# EAGLE design Naninator (EAGLE 6.2)
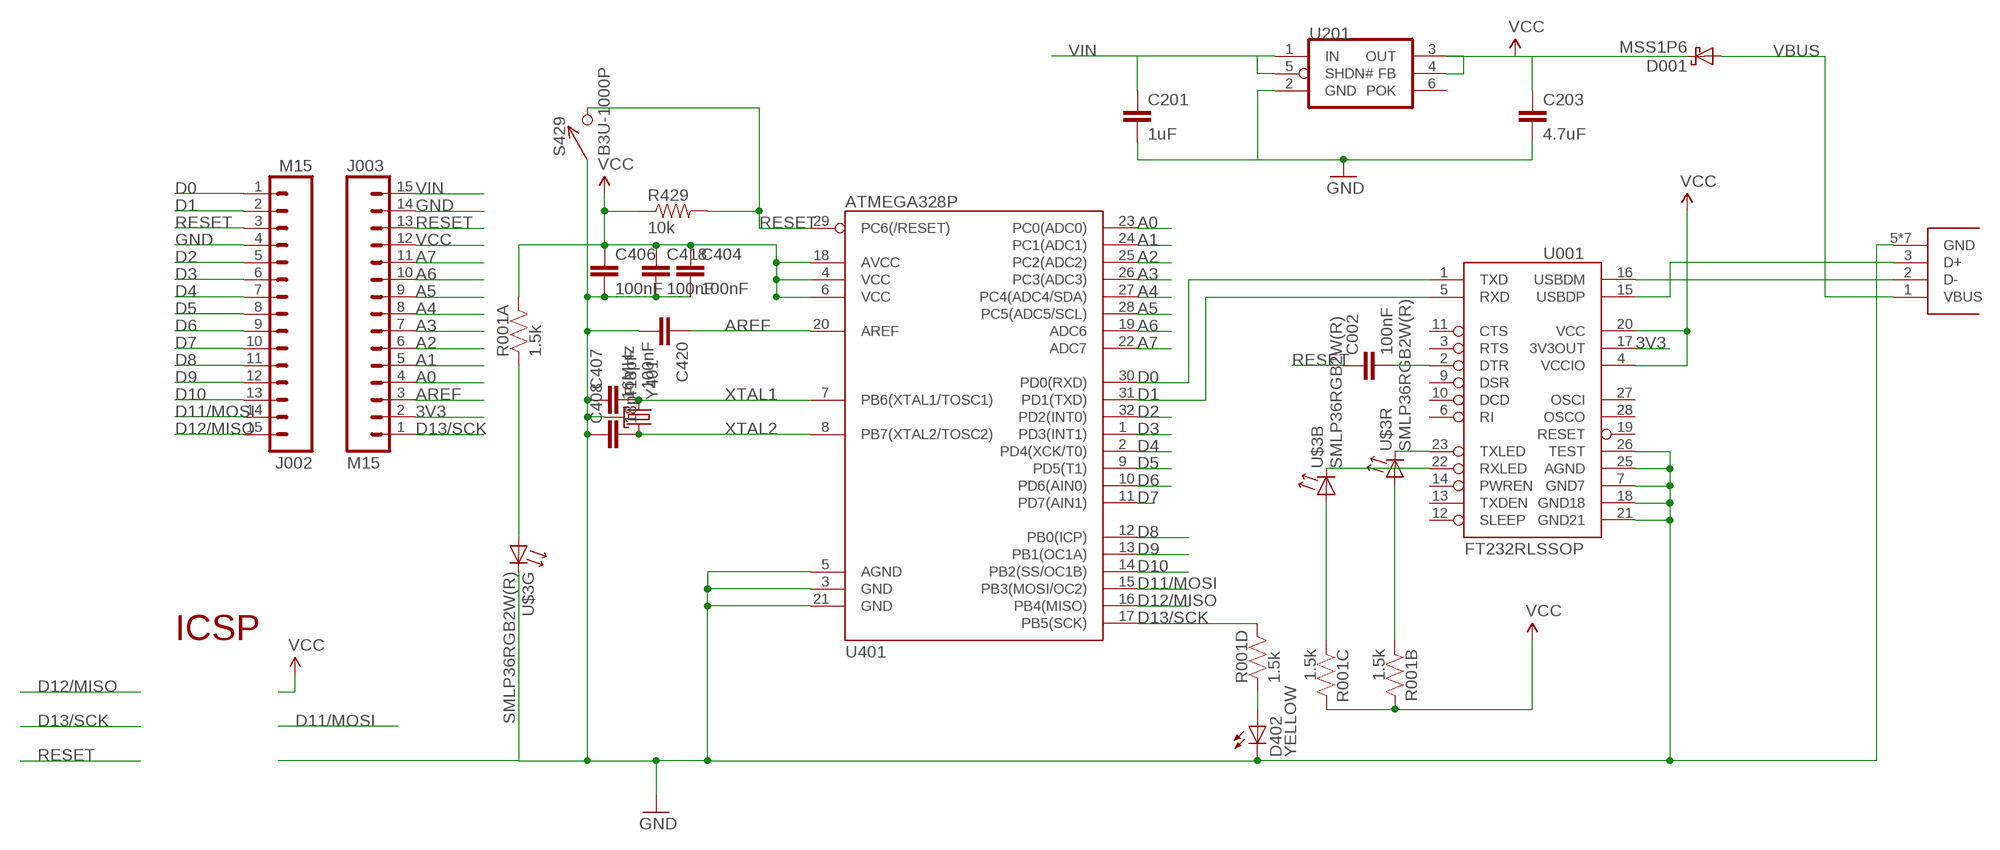
[diagram p0: schematic, sheet 1]

## Parts
C002  100nF  CAP0402-CAP  [0402-CAP]
C201  1uF  CAP0402-CAP  [0402-CAP]
C203  4.7uF  CAP0402-CAP  [0402-CAP]
C404  100nF  CAP0402-CAP  [0402-CAP]
C406  100nF  CAP0402-CAP  [0402-CAP]
C407  18pF  CAP0402-CAP  [0402-CAP]
C408  18pF  CAP0402-CAP  [0402-CAP]
C418  100nF  CAP0402-CAP  [0402-CAP]
C420  100nF  CAP0402-CAP  [0402-CAP]
D001  MSS1P6  [MICROSMP]
D402  YELLOW  LED0603  [LED-0603]
J001  USB_MICROB_JSTGCT  [USB_MICROB_3075]
J002  M15  [1X15]
J003  M15  [1X15]
R001  1.5k  RP404  [CRA04]
R429  10k  RESISTOR0402-RES  [0402-RES]
S429  B3U-1000P  [B3U-1000P]
U001  FT232RLSSOP  [SSOP28DB]
U201  MAX8881  [SOT-23-6]
U401  ATMEGA328P  ATMEGA168  [TQFP32-08]
U$3  SMLP36RGB2W(R)  [SMLP36]
Y401  16MHz  CX25208Y  [CRYSTAL_SMD_2MM_1_6MM]

## Nets
3V3: J003.2 U001.17(3V3OUT)
A0: J003.4 U401.23(PC0(ADC0))
A1: J003.5 U401.24(PC1(ADC1))
A2: J003.6 U401.25(PC2(ADC2))
A3: J003.7 U401.26(PC3(ADC3))
A4: J003.8 U401.27(PC4(ADC4/SDA))
A5: J003.9 U401.28(PC5(ADC5/SCL))
A6: J003.10 U401.19(ADC6)
A7: J003.11 U401.22(ADC7)
AREF: C420.1 J003.3 U401.20(AREF)
D0: J002.1 U001.1(TXD) U401.30(PD0(RXD))
D1: J002.2 U001.5(RXD) U401.31(PD1(TXD))
D2: J002.5 U401.32(PD2(INT0))
D3: J002.6 U401.1(PD3(INT1))
D4: J002.7 U401.2(PD4(XCK/T0))
D5: J002.8 U401.9(PD5(T1))
D6: J002.9 U401.10(PD6(AIN0))
D7: J002.10 U401.11(PD7(AIN1))
D8: J002.11 U401.12(PB0(ICP))
D9: J002.12 U401.13(PB1(OC1A))
D10: J002.13 U401.14(PB2(SS/OC1B))
D11/MOSI: J002.14 U401.15(PB3(MOSI/OC2))
D12/MISO: J002.15 U401.16(PB4(MISO))
D13/SCK: J003.1 R001.5 U401.17(PB5(SCK))
DTR#: C002.2 U001.2(DTR)
GND: C201.2 C203.2 C404.2 C406.2 C407.1 C408.1 C418.2 C420.2 D402.C J001.5(GND) J001.P$1(GND) J001.P$2(GND) J001.P$3(GND) J001.P$4(GND) J001.P$8(GND) J001.P$10(GND) J002.4 J003.14 S429.P$1 U001.7(GND7) U001.18(GND18) U001.21(GND21) U001.25(AGND) U001.26(TEST) U201.2(GND) U401.3(GND) U401.5(AGND) U401.21(GND) U$3.5(G:C) Y401.2(GND) Y401.4(GND)
N$3: J001.3(D+) U001.15(USBDP)
N$4: J001.2(D-) U001.16(USBDM)
N$5: R001.1 U$3.6(G:A)
N$6: R001.3 U$3.2(B:A)
N$7: R001.2 U$3.4(R:A)
N$8: D402.A R001.4
RESET: C002.1 J002.3 J003.13 R429.2 S429.P$2 U401.29(PC6(/RESET))
RXLED1: U001.22(RXLED) U$3.1(B:C)
TXLED1: U001.23(TXLED) U$3.3(R:C)
VBUS: D001.A J001.1(VBUS)
VCC: C203.1 C404.1 C406.1 C418.1 D001.K J003.12 R001.6 R001.7 R001.8 R429.1 U001.4(VCCIO) U001.20(VCC) U201.3(OUT) U201.4(FB) U401.4(VCC) U401.6(VCC) U401.18(AVCC)
VIN: C201.1 J003.15 U201.1(IN) U201.5(SHDN#)
XTAL1: C407.2 U401.7(PB6(XTAL1/TOSC1)) Y401.3
XTAL2: C408.2 U401.8(PB7(XTAL2/TOSC2)) Y401.1
Unconnected: U001.3(RTS) U001.6(RI) U001.9(DSR) U001.10(DCD) U001.11(CTS) U001.12(SLEEP) U001.13(TXDEN) U001.14(PWREN) U001.19(RESET) U001.27(OSCI) U001.28(OSCO) U201.6(POK)

## Notes on the sheet
- ICSP

## Library data of the parts
C002 C404 C406 C418 C420 = SparkFun:CAP: Capacitor Standard 0603 ceramic capacitor, and 0.1" leaded capacitor.; DIGIKEY: 445-1265-1-ND
C201 = SparkFun:CAP: Capacitor Standard 0603 ceramic capacitor, and 0.1" leaded capacitor.; DIGIKEY: 445-4114-1-ND
C203 = SparkFun:CAP: Capacitor Standard 0603 ceramic capacitor, and 0.1" leaded capacitor.; DIGIKEY: 445-7395-1-ND
C407 C408 = SparkFun:CAP: Capacitor Standard 0603 ceramic capacitor, and 0.1" leaded capacitor.; DIGIKEY: 445-1238-1-ND
D001 = KwanSystems:MSS1P6; DIGIKEY: MSS2P3-M3/89AGICT-ND
D402 = SparkFun-LED:LED: LEDs Standard schematic elements and footprints for 5mm, 3mm, 1206, and 0603 sized LEDs. 5mm - Spark Fun Electronics SKU : COM-00529 (and others); DIGIKEY: 350-2032-1-ND
J001 = KwanSystems:USB_MICROB_JST; DIGIKEY: 609-4616-2-ND
J002 J003 = SparkFun-Connectors:M15: Header 15 Standard 15-pin 0.1" header. Use with straight break away headers (SKU : PRT-00116), right angle break away headers (PRT-00553), swiss pins (PRT-00743), machine pins (PRT-00117), and female headers (PRT-00115).; DIGIKEY: A24931-ND
R001 = KwanSystems:RP4; DIGIKEY: CRA4S81.5KCT-ND
R429 = SparkFun-Passives:RESISTOR: Resistor Basic schematic elements and footprints for 0603, 1206, and PTH resistors.; DIGIKEY: P10.0KLCT-ND
S429 = KwanSystems:B3U-1000P; DIGIKEY: SW1020CT-ND
U001 = SparkFun-DigitalIC:FT232RL: USB UART FT232RL 4th Generation USB UART (USB <-> Serial) Controller. Spark Fun Electronics SKU : COM-00650; DIGIKEY: 768-1007-1-ND
U201 = KwanSystems:MAX8881; DIGIKEY: MAX8881EUT50+TCT-ND
U401 = SparkFun-DigitalIC:ATMEGA168: Atmel 32-pin 8-bit micro, 16k flash.; DIGIKEY: ATMEGA328P-15AZCT-ND
U$3 = KwanSystems:SMLP36RGB2W(R)
Y401 = KwanSystems:CX2520; DIGIKEY: 887-2003-1-ND

## Net classes
0 default: width 0.152 mm, drill 0.33 mm, clearance 0.152 mm

## Board
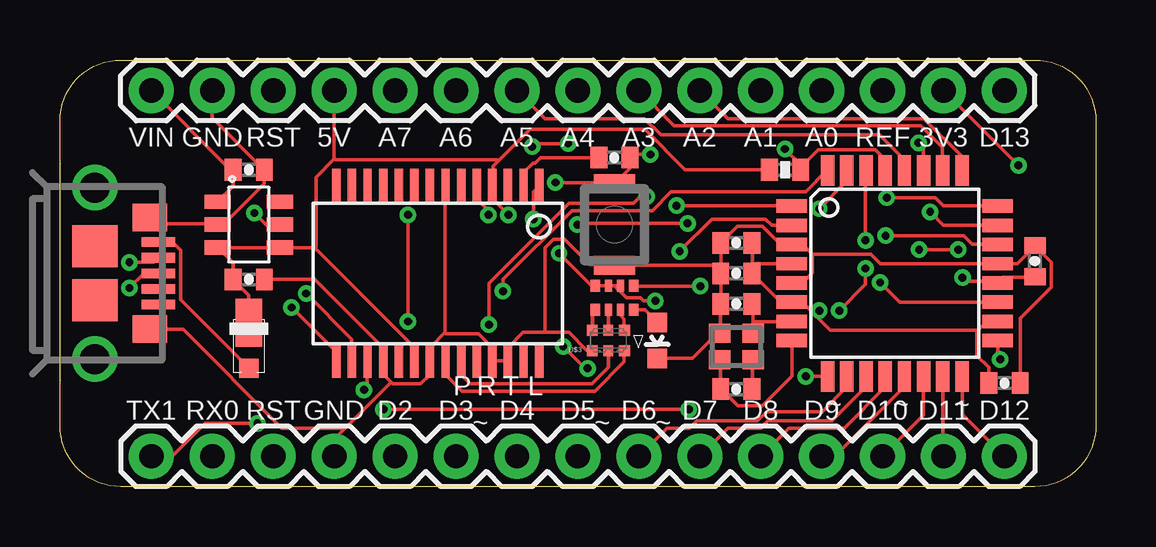
[diagram p1: board, top side]
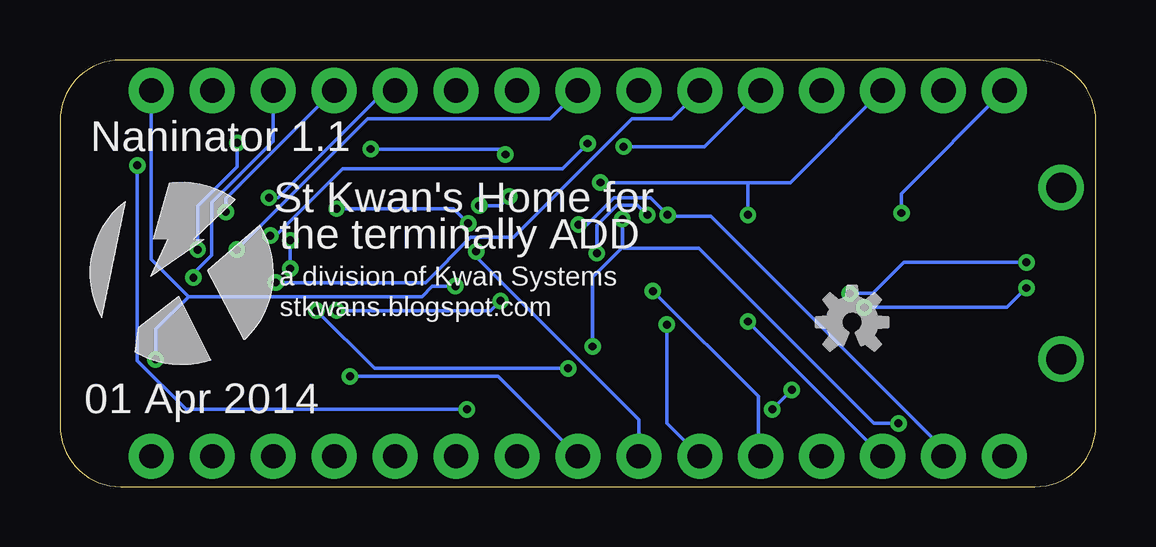
[diagram p2: board, bottom side, seen from below]

Size 43.18 x 17.78 mm. Coordinates in mm from the lower left corner, seen from the top.
Outline: 40.64,0 2.54,0 arc-90 0,2.54 0,15.24 arc-90 2.54,17.78 40.64,17.78 arc-90 43.18,15.24 43.18,2.54 arc-90 40.64,0
Copper layers (1*16): Top 0.0356mm / dielectric 1.5011mm / Bottom 0.0356mm
Design rules "default": minimum track width 6mil, minimum drill 13mil, track to track 6mil, track to pad 6mil, pad to pad 6mil, via to via 6mil, smd to smd 6mil, copper to edge 15mil, drill to drill 6mil, minimum pad ring 7mil, minimum via ring 7mil, stop-mask expansion 4mil, vias tented up to drill 14mil, thermal gap 10mil

### Footprints (pad centres in the part's own frame; a part is rotated, then mirrored left to right if it is on the bottom)
0402-CAP = smd 0.7 x 0.9: 1 -0.65,0; 2 0.65,0
MICROSMP = smd 0.8 x 0.8: A 0.9,0 | smd 2 x 1.1: K -1,0
LED-0603 = smd 0.8 x 0.8: A 0,-0.75; C 0,0.75
USB_MICROB_3075 = smd 0.4 x 1.4: 1 -1.3,4.1; 2 -0.65,4.1; 3 0,4.1; 4 0.65,4.1; 5 1.3,4.1 | smd 1.15 x 1.45: P$1 2.32,3.75; P$10 -2.32,3.75 | smd 1.75 x 1.9: P$2 1.125,1.45; P$8 -1.125,1.45 | drill 1.25 pad 1.9: P$3 -3.575,1.45; P$4 3.575,1.45
1X15 = drill 1.016 pad 1.88: 1 0,0; 2 2.54,0; 3 5.08,0; 4 7.62,0; 5 10.16,0; 6 12.7,0; 7 15.24,0; 8 17.78,0; 9 20.32,0; 10 22.86,0; 11 25.4,0; 12 27.94,0; 13 30.48,0; 14 33.02,0; 15 35.56,0
CRA04 = smd 0.4 x 0.5: 1 -0.8,-0.5; 4 0.8,-0.5; 5 0.8,0.5; 8 -0.8,0.5 | smd 0.3 x 0.5: 2 -0.25,-0.5; 3 0.25,-0.5; 6 0.25,0.5; 7 -0.25,0.5
0402-RES = smd 0.7 x 0.9: 1 -0.65,0; 2 0.65,0
B3U-1000P = smd 0.8 x 1.7: P$1 -1.7,0; P$2 1.7,0
SSOP28DB = smd 0.348 x 1.397: 1 -4.225,-3.656; 2 -3.575,-3.656; 3 -2.925,-3.656; 4 -2.275,-3.656; 5 -1.625,-3.656; 6 -0.975,-3.656; 7 -0.325,-3.656; 8 0.325,-3.656; 9 0.975,-3.656; 10 1.625,-3.656; 11 2.275,-3.656; 12 2.925,-3.656; 13 3.575,-3.656; 14 4.225,-3.656; 15 4.225,3.656; 16 3.575,3.656; 17 2.925,3.656; 18 2.275,3.656; 19 1.625,3.656; 20 0.975,3.656; 21 0.325,3.656; 22 -0.325,3.656; 23 -0.975,3.656; 24 -1.625,3.656; 25 -2.275,3.656; 26 -2.925,3.656; 27 -3.575,3.656; 28 -4.225,3.656
SOT-23-6 = smd 0.6 x 1.1: 1 -0.95,-1.3; 2 0,-1.3; 3 0.95,-1.3; 4 0.95,1.3; 5 0,1.3; 6 -0.95,1.3
TQFP32-08 = smd 1.27 x 0.559: 1 -4.293,2.8; 2 -4.293,2; 3 -4.293,1.2; 4 -4.293,0.4; 5 -4.293,-0.4; 6 -4.293,-1.2; 7 -4.293,-2; 8 -4.293,-2.8; 17 4.293,-2.8; 18 4.293,-2; 19 4.293,-1.2; 20 4.293,-0.4; 21 4.293,0.4; 22 4.293,1.2; 23 4.293,2; 24 4.293,2.8 | smd 0.559 x 1.27: 9 -2.8,-4.293; 10 -2,-4.293; 11 -1.2,-4.293; 12 -0.4,-4.293; 13 0.4,-4.293; 14 1.2,-4.293; 15 2,-4.293; 16 2.8,-4.293; 25 2.8,4.293; 26 2,4.293; 27 1.2,4.293; 28 0.4,4.293; 29 -0.4,4.293; 30 -1.2,4.293; 31 -2,4.293; 32 -2.8,4.293
SMLP36 = smd 0.45 x 0.45: 1 -0.675,0.425; 2 -0.675,-0.425; 5 0.675,0.425; 6 0.675,-0.425 | smd 0.4 x 0.45: 3 0,0.425; 4 0,-0.425
CRYSTAL_SMD_2MM_1_6MM = smd 0.9 x 0.8: 1 -0.7,-0.55; 2 0.7,-0.55; 3 0.7,0.55; 4 -0.7,0.55

### Placement (x,y rotation side)
C002  23.11,13.72 180 top
C201  7.87,13.21 0 top
C203  7.87,8.64 0 top
C404  28.19,10.16 180 top
C406  28.19,8.89 180 top
C407  28.19,7.62 0 top
C408  28.19,4.06 180 top
C418  39.37,4.32 0 top
C420  40.64,9.4 90 top
D001  7.87,5.84 270 top
D402  24.89,6.1 180 top
J001  0,8.89 270 top
J002  3.81,1.27 0 top
J003  39.37,16.51 180 top
R001  23.11,7.87 0 top
R429  30.23,13.21 0 top
S429  23.11,10.92 90 top
U001  15.75,8.89 180 top
U201  7.87,10.92 270 top
U401  34.8,8.89 0 top
U$1  [KWAN_CIRCLE]  38.1,8.89 0 bottom
U$2  [OSHW-LOGO-S]  10.16,6.86 0 bottom
U$3  22.86,6.1 180 top
Y401  28.19,5.84 0 top

### Tracks (layer width: path | path; a pad name or v marks a point on that pad's centre or on a via)
3V3  (via drill 0.33)
  Top 0.152: v12.68,4.04 12.8,4.17 12.8,5.23 U001.17 | v26.21,3.23 v13.49,3.23 | J003.2 v39.95,13.39
  Bottom 0.152: v13.49,3.23 v12.68,4.04 | v26.21,3.23 37.92,3.23 39.95,5.26 v39.95,13.39
A0  (via drill 0.33)
  Top 0.152: v36.27,11.46 36.83,10.9 U401.23
  Bottom 0.152: v36.27,11.46 36.27,11.99 J003.4
A1  (via drill 0.33)
  Top 0.152: v34.47,12.04 36.5,12.04 36.83,11.71 39.09,11.71 U401.24
  Bottom 0.152: v34.47,12.04 34.09,12.04 29.62,16.51 J003.5
A2
  Top 0.152: J003.6 27.84,15.34 36.02,15.34 37.59,13.77 U401.25
A3
  Top 0.152: J003.7 25.6,15.04 35.89,15.04 36.78,14.15 36.78,13.18 U401.26
A4  (via drill 0.33)
  Top 0.152: v35.79,14.33 35.99,14.12 U401.27 | v35.81,9.88 v37.44,9.88
  Bottom 0.152: v35.79,14.33 35.79,13.34 37.44,11.68 v37.44,9.88 | v35.81,9.88 30.35,15.34 22.76,15.34 J003.8
A5
  Top 0.152: J003.9 20.22,15.34 24.36,15.34 25.04,14.66 34.16,14.66 35.18,13.64 35.18,13.18 U401.28
A6  (via drill 0.33)
  Top 0.152: v34.19,8.51 35,7.7 U401.19
  Bottom 0.152: v34.19,8.51 27.94,8.51 26.06,10.39 24.28,10.39 19.33,15.34 17.68,15.34 J003.10
A7  (via drill 0.33)
  Top 0.152: v34.42,10.46 37.67,10.46 38.02,10.11 39.09,10.11 U401.22 | v21.18,14.3 19.81,14.3 v19.68,14.17
  Bottom 0.152: v34.42,10.46 34.19,10.46 31.39,13.26 22.23,13.26 v21.18,14.3 | v19.68,14.17 16.31,14.17 J003.11
AREF  (via drill 0.33)
  Top 0.152: C420.1 40.64,8.74 39.32,8.74 39.09,8.51 U401.20 39.04,8.56 37.77,8.56 v37.62,8.71
  Bottom 0.152: v37.62,8.71 37.62,8.89 36.85,9.65 36.85,11.84 34.29,14.4 J003.3
D0  (via drill 0.33)
  Top 0.152: v33.58,10.26 33.58,13.18 U401.30 | v33.58,9.09 33.58,8.43 v32.49,7.34 | v22,4.93 21.89,4.93 v20.98,5.84 | v19.74,11.15 19.74,12.29 19.96,12.52 U001.1 | J002.1 4.67,1.27 6.04,2.64 v8.23,2.64
  Bottom 0.152: v33.58,9.09 v33.58,10.26 | v32.49,7.34 30.07,4.93 v22,4.93 | v20.98,5.84 20.98,8.74 19.74,9.98 | v19.74,11.15 19.74,9.98 | v8.23,2.64 9.25,2.64 16.54,9.93 19.68,9.93 19.74,9.98
D1  (via drill 0.33)
  Top 0.152: v31.65,11.58 32.79,12.72 U401.31 | v26.16,10.97 21.61,10.97 v21.57,10.92 | v17.86,11.33 17.86,11.51 17.37,11.99 17.37,12.52 U001.5
  Bottom 0.152: v31.65,11.58 26.77,11.58 v26.16,10.97 | v21.57,10.92 21.21,10.92 20.09,12.04 18.57,12.04 v17.86,11.33 17.8,11.28 16.05,11.28 6.35,1.57 J002.2
D2  (via drill 0.33)
  Top 0.152: v18.47,8.15 18.47,8.64 21.34,11.51 24.69,11.51 25.48,12.29 31.09,12.29 31.98,13.18 U401.32
  Bottom 0.152: v18.47,8.15 14.07,3.76 14.07,1.37 J002.5
D3  (via drill 0.33)
  Top 0.152: v25.7,11.71 30.5,11.71 U401.1 | v24.46,12.09 24.18,12.09 23.9,11.81 21.21,11.81 17.88,8.48 v17.88,6.76
  Bottom 0.152: v25.7,11.71 24.84,11.71 v24.46,12.09 | v17.88,6.76 17.88,2.64 J002.6
D4  (via drill 0.33)
  Top 0.152: v25.83,9.8 27.18,11.15 29.41,11.15 29.67,10.9 U401.2
  Bottom 0.152: v25.83,9.8 25.83,9.58 19.05,2.79 J002.7
D5  (via drill 0.33)
  Top 0.152: v31.09,4.6 U401.9
  Bottom 0.152: v31.09,4.6 24.92,4.6 J002.8
D6
  Top 0.152: J002.9 25.3,2.44 26.24,2.44 26.54,2.74 29.08,2.74 29.46,3.12 31.77,3.12 32.79,4.14 U401.10
D7
  Top 0.152: J002.10 27.84,2.44 29.21,2.44 29.52,2.74 32.18,2.74 33.58,4.14 33.58,4.6 U401.11
D8
  Top 0.152: J002.11 30.38,2.44 32.69,2.44 34.39,4.14 U401.12
D9
  Top 0.152: J002.12 32.31,1.27 35.18,4.14 35.18,4.6 U401.13
D10
  Top 0.152: J002.13 35.99,2.97 U401.14
D11/MOSI
  Top 0.152: J002.14 36.8,1.29 U401.15
D12/MISO
  Top 0.152: J002.15 37.62,3.02 37.62,4.6 U401.16
D13/SCK  (via drill 0.33)
  Top 0.152: v26.7,8.36 23.93,8.36 R001.5 | U401.17 39.09,5.41 v39.19,5.31
  Bottom 0.152: v26.7,8.36 27.66,8.36 28.09,7.92 37.82,7.92 | 37.82,7.92 39.37,9.47 J003.1 | v39.19,5.31 39.19,6.55 37.82,7.92
DTR#
  Top 0.152: C002.2 20.04,13.72 19.81,13.49 19.71,13.49 19.33,13.11 U001.2
GND
  Top 0.152: J001.P$10 4.01,10.95 6.5,10.95 U201.2 6.81,10.92 8.51,12.62 C201.2 8.46,13.26 6.35,15.37 J003.14 | C418.2 40.03,7.01 41.33,8.31 41.33,9.35 40.64,10.03 C420.2 40.59,9.98 39.9,9.3 U401.21 39.04,9.3 34.19,9.3 33.81,9.68 31.37,9.68 | 31.37,9.68 31.37,8.91 30.96,8.51 30.5,8.51 U401.5 | 31.37,9.68 30.96,10.08 U401.3 30.45,10.13 30,10.13 29.29,10.85 28.25,10.85 27.61,10.21 C404.2 27.56,10.16 27.56,8.94 C406.2 | D402.C 26.36,5.36 27.38,6.38 27.48,6.38 Y401.4 27.53,6.45 C407.1 27.56,7.67 27.56,8.89 C406.2 | C408.1 28.85,4.06 28.85,5.26 Y401.2 | C406.2 27.51,9.22 S429.P$1 23.06,9.27 22.07,9.27 21.03,10.31 20.57,10.31 20.22,9.96 20.22,6.43 | 20.22,6.43 19.3,6.43 18.69,5.82 18.69,5.26 U001.26 18.62,5.26 18.03,5.26 U001.25 18.03,5.33 18.03,5.79 17.45,6.38 16.1,6.38 16.05,6.43 | 20.22,6.43 21.21,6.43 21.95,5.69 22.17,5.69 U$3.5 | C203.2 10.62,8.64 13.46,5.79 13.46,5.26 U001.18 13.51,5.18 13.51,4.65 13.8,4.36 | 13.8,4.36 13.87,4.29 15.04,4.29 15.42,4.67 U001.21 15.44,5.31 15.44,5.82 16.05,6.43 | 16.05,6.43 16.05,12.52 U001.7 | J002.4 11.43,1.98 11.84,2.39 | 13.8,4.36 11.84,2.39 | J001.P$1 3.76,6.55 5.13,6.55 9.25,2.44 11.79,2.44 11.84,2.39
N$3  (via drill 0.33)
  Top 0.152: v9.65,7.47 11.51,5.61 11.51,5.26 U001.15 | v2.9,8.28 3.5,8.89 J001.3
  Bottom 0.152: v9.65,7.47 3.71,7.47 v2.9,8.28
N$4  (via drill 0.33)
  Top 0.152: v10.26,8.05 12.17,6.15 12.17,5.26 U001.16 | v2.9,9.35 3.91,9.35 4.09,9.53 J001.2
  Bottom 0.152: v10.26,8.05 9.3,8.05 8,9.35 v2.9,9.35
N$5
  Top 0.152: U$3.6 22.2,6.53 22.2,7.26 R001.1
N$6
  Top 0.152: U$3.2 23.52,6.53 23.52,6.99 23.37,7.14 R001.3
N$7
  Top 0.152: U$3.4 R001.2
N$8
  Top 0.152: R001.4 23.93,7.37 24.38,7.37 D402.A
RESET  (via drill 0.33)
  Top 0.152: U401.29 34.39,13.64 33.98,14.05 31.62,14.05 30.89,13.31 R429.2 30.89,13.41 v30.23,14.07 | v20.65,12.68 23.06,12.68 S429.P$2 23.75,13.26 23.75,13.72 C002.1 23.82,13.74 23.93,13.84 v24.61,13.84 | v14.5,11.33 v14.5,6.88
  Bottom 0.152: 14.5,12.68 12.72,12.68 J003.13 | 14.5,12.68 v20.65,12.68 | v30.23,14.07 24.84,14.07 v24.61,13.84 | v14.5,6.88 J002.3 | 14.5,12.68 v14.5,11.33
RXLED1
  Top 0.152: U$3.1 23.52,5.66 23.52,5.21 22.3,3.99 16.76,3.99 16.08,4.67 U001.22
TXLED1
  Top 0.152: U$3.3 22.86,4.98 22.17,4.29 17.09,4.29 16.74,4.65 16.74,5.23 U001.23
VBUS
  Top 0.152: D001.A 7.87,4.95 5.03,7.8 5.03,9.86 4.7,10.19 4.12,10.19 J001.1
VCC  (via drill 0.33)
  Top 0.152: 10.62,9.96 14.76,5.82 14.76,5.26 U001.20 | 10.62,9.96 9.25,9.96 U201.4 9.17,9.96 6.68,9.96 U201.3 6.58,9.96 7.21,9.32 C203.1 7.26,8.59 7.87,7.98 D001.K | 11.43,13.66 J003.12 | 11.43,13.66 10.67,12.9 10.67,10.01 10.62,9.96 | 38.23,6.48 38.23,5.46 38.71,4.98 C418.1 | 38.23,6.48 38.63,6.88 U401.18 | C406.1 28.85,8.89 28.85,10.16 C404.1 | C406.1 28.91,8.84 30.05,7.7 U401.6 30.56,7.64 30.99,7.64 31.47,7.16 | U401.4 28.91,9.3 C406.1 | 31.47,7.16 32.11,6.53 38.18,6.53 38.23,6.48 | 23.16,8.38 22.94,8.38 R001.7 22.86,8.38 22.33,8.38 R001.8 22.25,8.41 22.12,8.41 v20.8,9.73 | 23.16,8.38 23.34,8.38 R001.6 | v18.69,11.33 18.03,11.99 18.03,12.52 U001.4 18.06,12.6 18.06,13.36 18.26,13.56 | R429.1 26.06,13.21 24.38,14.88 19.58,14.88 18.26,13.56 | v31.65,7.34 31.47,7.16 | v24.82,7.75 24.33,7.75 24.21,7.87 23.62,7.87 23.16,8.33 23.16,8.38 | 11.43,13.66 11.48,13.61 18.21,13.61 18.26,13.56
  Bottom 0.152: v20.8,9.73 20.8,10.9 19.96,11.73 19.1,11.73 v18.69,11.33 | v31.65,7.34 25.22,7.34 v24.82,7.75
VIN  (via drill 0.33)
  Top 0.152: U201.1 6.58,11.89 7.21,12.52 C201.1 7.16,13.26 7.06,13.26 J003.15 | U201.5 8.59,10.92 v8.1,11.4
  Bottom 0.152: v8.1,11.4 8.1,12.22 J003.15
XTAL1
  Top 0.152: 28.88,6.88 28.88,7.59 28.85,7.62 C407.2 | 28.88,6.88 Y401.3 | 28.88,6.88 U401.7
XTAL2
  Top 0.152: Y401.1 27.51,5.28 27.53,5.26 C408.2 27.61,4.04 28.27,3.38 29.29,3.38 30.5,4.6 U401.8

### Text on the board
tPlace: VIN | GND | RST | 5V | A7 | A6 | A5 | A4 | A3 | A2 | A1 | A0 | REF | 3V3 | D13 | P | R | T | L | TX1 | RX0 | RST | GND | D2 | D3 | D4 | D5 | D6 | D7 | D8 | D9 | ~ | D10 | ~ | D11 | ~ | D12 | ~ | ~ | ~
bPlace: Naninator 1.1 | St Kwan's Home for | the terminally ADD | a division of Kwan Systems | stkwans.blogspot.com | 01 Apr 2014